# Altium schematic sheet LAB_3_page1.SchDoc
size A4; SheetNumber: 1; SheetTotal: 2
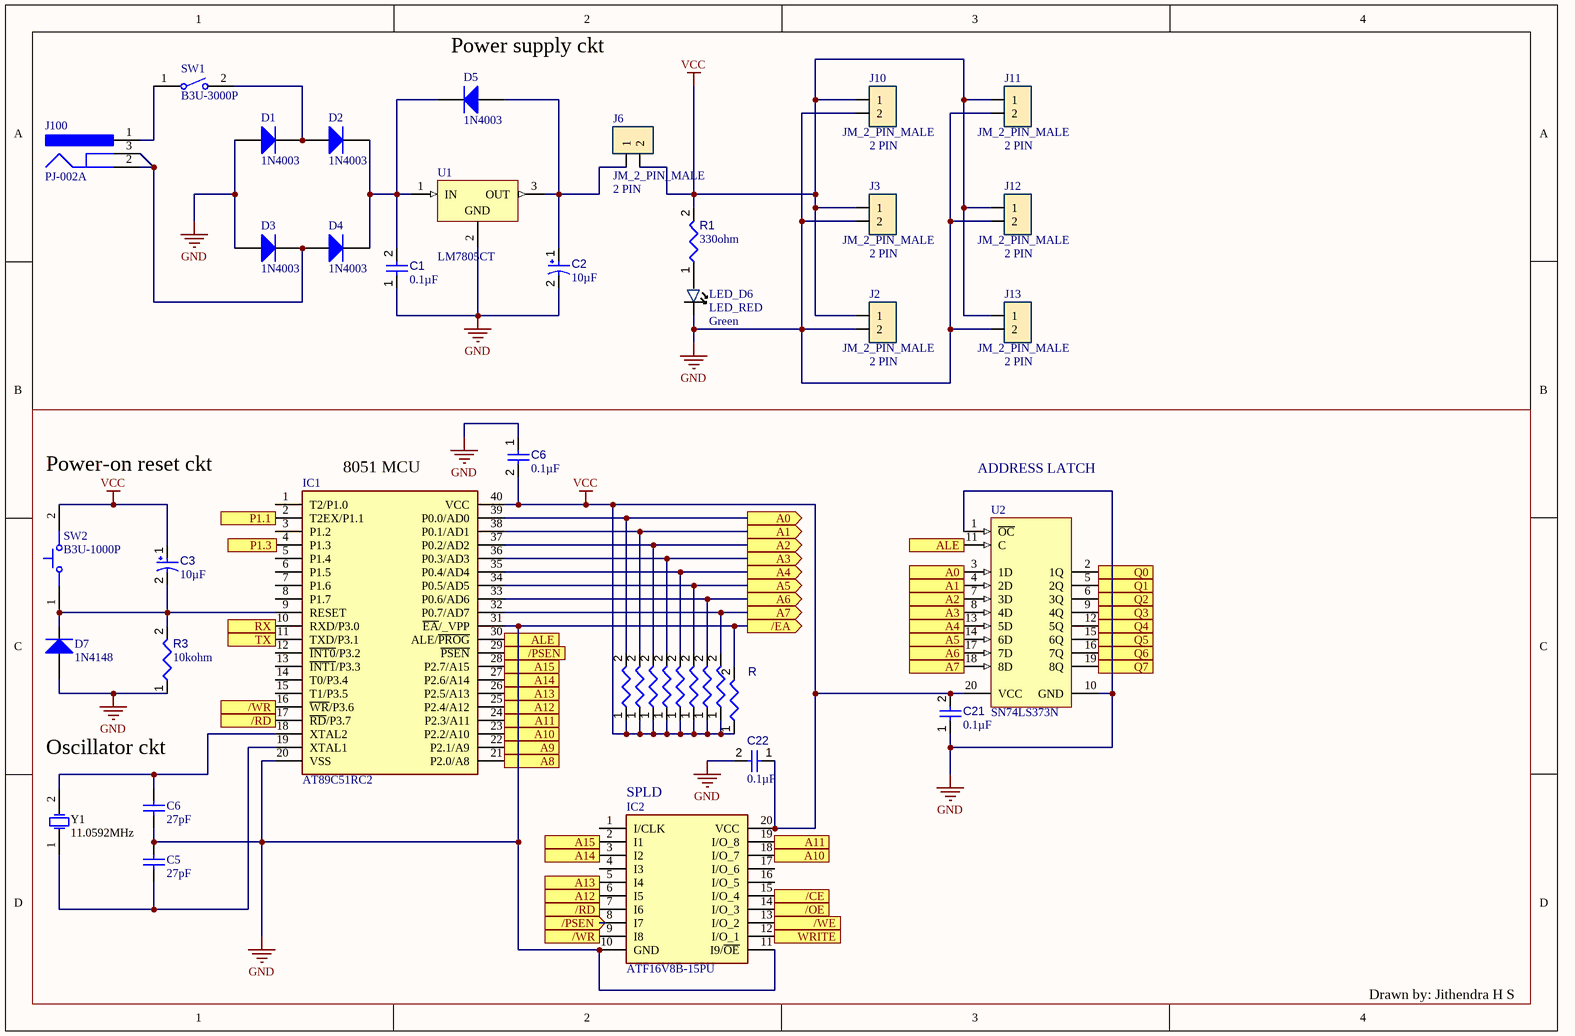
[diagram p0: LAB_3_page1.SchDoc]

## Parts
(Parts that share a designator on the sheet are numbered #1, #2 ... from top to bottom, then left to right.)
?#1  Resistor 4k7 +/-1% 1206 250 mW  [RESC3116X70X50ML13T20]  (value not drawn)
?#2  Resistor 4k7 +/-1% 1206 250 mW  [RESC3116X70X50ML13T20]  (value not drawn)
?#3  Resistor 4k7 +/-1% 1206 250 mW  [RESC3116X70X50ML13T20]  (value not drawn)
?#4  Resistor 4k7 +/-1% 1206 250 mW  [RESC3116X70X50ML13T20]  (value not drawn)
?#5  Resistor 4k7 +/-1% 1206 250 mW  [RESC3116X70X50ML13T20]  (value not drawn)
?#6  Resistor 4k7 +/-1% 1206 250 mW  [RESC3116X70X50ML13T20]  (value not drawn)
?#7  Resistor 4k7 +/-1% 1206 250 mW  [RESC3116X70X50ML13T20]  (value not drawn)
?#8  Resistor 4k7 +/-1% 1206 250 mW  [RESC3116X70X50ML13T20]  (value not drawn)
C1  value 0.1µF  [CAPC2013X145X50ML20T25]  (hidden comment: Capacitor 1 uF +/- 10% 25 V 0805)
C2  value 10µF  [CAPPR55-200-1100X500X1200]  (hidden comment: ECA1HM100)
C3  value 10µF  [CAPPR55-200-1100X500X1200]  (hidden comment: ECA1HM100)
C5  value 27pF  (hidden comment: Capacitor)
C6#1  value 0.1µF  [CAPC2013X145X50ML20T25]  (hidden comment: Capacitor 1 uF +/- 10% 25 V 0805)
C6#2  value 27pF  (hidden comment: Capacitor)
C21  value 0.1µF  [CAPC2013X145X50ML20T25]  (hidden comment: Capacitor 1 uF +/- 10% 25 V 0805)
C22  value 0.1µF  [CAPC2013X145X50ML20T25]  (hidden comment: Capacitor 1 uF +/- 10% 25 V 0805)
D1  1N4003  [FAIR-DO-41-2]
D2  1N4003  [FAIR-DO-41-2]
D3  1N4003  [FAIR-DO-41-2]
D4  1N4003  [FAIR-DO-41-2]
D5  1N4003  [FAIR-DO-41-2]
D7  1N4148  [NXP-SOD27-2_V]
IC1  AT89C51RC2  [DIP1524W56P254L5230H483Q40N]
IC2  ATF16V8B-15PU  [DIP794W59P254L2591H533Q20N]
J2  JM_2_PIN_MALE  value 2 PIN  [2_PIN_100MIL]
J3  JM_2_PIN_MALE  value 2 PIN  [2_PIN_100MIL]
J6  JM_2_PIN_MALE  value 2 PIN  [2_PIN_100MIL]
J10  JM_2_PIN_MALE  value 2 PIN  [2_PIN_100MIL]
J11  JM_2_PIN_MALE  value 2 PIN  [2_PIN_100MIL]
J12  JM_2_PIN_MALE  value 2 PIN  [2_PIN_100MIL]
J13  JM_2_PIN_MALE  value 2 PIN  [2_PIN_100MIL]
J100  PJ-002A  [CUI-PJ-002A_V]
LED_D6  LED_RED  value Green  [LED_0603]
R  Resistor 4k7 +/-1% 1206 250 mW  [RESC3116X70X50ML13T20]  (value not drawn)
R1  value 330ohm  [RESA60-630X240]  (hidden comment: MFR-25FBF52-1K)
R3  value 10kohm  [RESA60-630X240]  (hidden comment: MFR-25FBF52-100K)
SW1  B3U-3000P  [OMRON-B3U-3000P_V]
SW2  B3U-1000P  [OMRON-B3U-1000_V]
U1  LM7805CT  [FAIR-TO-220-3]
U2  SN74LS373N  [N0020A]
Y1  11.0592MHz  [FOX-FOXSLF-2_V]

## Ports
/CE (out), /EA (out), /OE (out), /PSEN (in), /PSEN (out), /RD (in), /RD (out), /WE (out), /WR, /WR (in), A0 (in), A0 (out), A1 (in), A1 (out), A2 (in), A2 (out), A3 (in), A3 (out), A4 (in), A4 (out), A5 (in), A5 (out), A6 (in), A6 (out), A7 (in), A7 (out), A8 (out), A9 (out), A10, A10 (out), A11, A11 (out), A12 (in), A12 (out), A13 (in), A13 (out), A14 (in), A14 (out), A15 (in), A15 (out), ALE (in), ALE (out), P1.1 (out), P1.3 (in), Q0, Q1, Q2, Q3, Q4, Q5, Q6, Q7, RX (in), TX (out), WRITE (out)

## Nets
GND: C1.1 C2.2 C5.2 C6#1.1 C6#2.1 C21.1 C22.2 D1.1(A) D3.1(A) D7.1(A) IC1.20(VSS) IC1.31(~{EA}/_VPP) IC2.10(GND) IC2.11(I9/~{OE}) J2.2 J3.2 J10.2 J11.2 J12.2 J13.2 LED_D6.2 R.2 R3.1 U1.2(GND) U2.1(~{OC}) U2.10(GND) ; port /EA
VCC: ?#1.1 ?#2.1 ?#3.1 ?#4.1 ?#5.1 ?#6.1 ?#7.1 ?#8.1 C3.1 C6#1.2 C21.2 C22.1 IC1.40(VCC) IC2.20(VCC) J2.1 J3.1 J6.2 J10.1 J11.1 J12.1 J13.1 R.1 R1.2 SW2.2 U2.20(VCC)
/CE: IC2.15(I/O_4) ; port /CE
/OE: IC2.14(I/O_3) ; port /OE
/PSEN: IC1.29(~{PSEN}) IC2.8(I7) ; port /PSEN
/RD: IC1.17(~{RD}/P3.7) IC2.7(I6) ; port /RD
/WE: IC2.13(I/O_2) ; port /WE
/WR: IC1.16(~{WR}/P3.6) IC2.9(I8) ; port /WR
A0: ?#1.2 IC1.39(P0.0/AD0) U2.3(1D) ; port A0
A1: ?#2.2 IC1.38(P0.1/AD1) U2.4(2D) ; port A1
A2: ?#3.2 IC1.37(P0.2/AD2) U2.7(3D) ; port A2
A3: ?#4.2 IC1.36(P0.3/AD3) U2.8(4D) ; port A3
A4: ?#5.2 IC1.35(P0.4/AD4) U2.13(5D) ; port A4
A5: ?#6.2 IC1.34(P0.5/AD5) U2.14(6D) ; port A5
A6: ?#7.2 IC1.33(P0.6/AD6) U2.17(7D) ; port A6
A7: ?#8.2 IC1.32(P0.7/AD7) U2.18(8D) ; port A7
A8: IC1.21(P2.0/A8) ; port A8
A9: IC1.22(P2.1/A9) ; port A9
A10: IC1.23(P2.2/A10) IC2.18(I/O_7) ; port A10
A11: IC1.24(P2.3/A11) IC2.19(I/O_8) ; port A11
A12: IC1.25(P2.4/A12) IC2.6(I5) ; port A12
A13: IC1.26(P2.5/A13) IC2.5(I4) ; port A13
A14: IC1.27(P2.6/A14) IC2.3(I2) ; port A14
A15: IC1.28(P2.7/A15) IC2.2(I1) ; port A15
ALE: IC1.30(ALE/~{PROG}) U2.11(C) ; port ALE
P1.1: IC1.2(T2EX/P1.1) ; port P1.1
Q0: U2.2(1Q) ; port Q0
Q1: U2.5(2Q) ; port Q1
Q2: U2.6(3Q) ; port Q2
Q3: U2.9(4Q) ; port Q3
Q4: U2.12(5Q) ; port Q4
Q5: U2.15(6Q) ; port Q5
Q6: U2.16(7Q) ; port Q6
Q7: U2.19(8Q) ; port Q7
RX: IC1.10(RXD/P3.0) ; port RX
TX: IC1.11(TXD/P3.1) ; port TX
WRITE: IC2.12(I/O_1) ; port WRITE
NetC1_2: C1.2 D2.2(K) D4.2(K) D5.2(K) U1.1(IN)
NetC2_1: C2.1 D5.1(A) J6.1 U1.3(OUT)
NetC3_2: C3.2 D7.2(K) IC1.9(RESET) R3.2 SW2.1
NetC5_1: C5.1 IC1.19(XTAL1) Y1.1
NetC6#2_2: C6#2.2 IC1.18(XTAL2) Y1.2
NetD1_2: D1.2(K) D2.1(A) SW1.2
NetD3_2: D3.2(K) D4.1(A) J100.2 J100.3
NetJ100_1: J100.1 SW1.1
NetLED_D6_1: LED_D6.1 R1.1

Not connected (* = marked no-connect by the designer): IC1 1(T2/P1.0) 3(P1.2) 4(P1.3) 5(P1.4) 6(P1.5) 7(P1.6) 8(P1.7) 12(~{INT0}/P3.2) 13(~{INT1}/P3.3) 14(T0/P3.4) 15(T1/P3.5); IC2 1(I/CLK) 4(I3) 16(I/O_5) 17(I/O_6)

## Notes on the sheet
- (near D5) Power supply ckt
- Power-on reset ckt
- (near IC1) 8051 MCU
- ADDRESS LATCH
- Oscillator ckt
- (near IC2) SPLD
- Drawn by: Jithendra H S

## Library data of the parts
?#1-?#8 R = CMP-009-00033-5: Chip Resistor, 4.7 KOhm, +/- 1%, 0.25 W, -55 to 155 degC, 1206 (3216 Metric); Power: 250mW; Voltage Rating: 200V; Pins: 2; Min Operating Temperature: -55°C; Max Operating Temperature: 155°C; Case/Package: 1206; Tolerance: 1%; RoHS Compliant: True; Mounting Technology: SM
C1 C6#1 C21 C22 = CMP-001-00010-6: Chip Capacitor, 1 uF, +/-10%, 25 V, 0805 (2012 Metric); Capacitor Type: Ceramic; Voltage Rating: 25V; RoHS Compliant: True; Pins: 2; Mounting Technology: SM; Max Operating Temperature: 125°C; Min Operating Temperature: -55°C; Tolerance: 10%; Case/Package: 0805
C2 C3 = CMP-001-00025-7: Aluminum Electrolytic Capacitor, 10 uF, +/- 20%, 50 V, -40 to 85 degC, 2-Pin THD, RoHS, Bulk; Manufacturer: Panasonic; Ripple Current (AC): 65mA; Voltage Rating: 50V; Mounting Technology: TH; RoHS Compliant: True; Capacitor Type: Electrolytic; Datasheet Version: Rev. 05, 10/2016; Min Operating Temperature: -40°C; Packaging: Bulk; Ripple Current: 65mA; Tolerance: 20%; Max Operating Temperature: 85°C; Datasheet URL: https://industrial.panasonic.com/cdbs/www-data/pdf/RDF0000/ABA0000C1218.pdf; Lead Pitch: 2mm; Pins: 2; Diameter: 5mm; Manufacturer URL: http://www.panasonic.com/; Package Reference: CAPPR55-200-1100X500X1200; Package Description: 2-Pin Radial Lead, Dia 5 mm, Height 12 mm; Case/Package: Radial; Package Quantity: 200
C5 C6#2 = Capacitor: SimulationGenericComponent: True
D1-D5 = CMP-004-00004-2: General Purpose Rectifier, 400 V, 1 A, -55 to 175 degC, 2-Pin DO-204AL (DO-41), RoHS, Tape and Reel; Manufacturer: Fairchild Semiconductor; Forward Voltage: 1.1V; Forward Current: 1A; Max Surge Current: 30A; Package Version: Rev. 2, 09/2008; Peak Reverse Current: 50A; Case/Package: DO-41-2; Pins: 2; RoHS Compliant: True; Diameter: 2.72mm; Package Reference: DO-41-2; Datasheet URL: https://www.fairchildsemi.com/datasheets/1N/1N4004.pdf; Manufacturer URL: https://www.fairchildsemi.com/; Max Operating Temperature: 175°C; Datasheet Version: Rev. 1.1.0, 11/2014; Package URL: http://www.fairchildsemi.com/dwg/DO/DO41A.pdf; Package Quantity: 5000; Min Operating Temperature: -55°C; Package Description: 2-Pin Axial Lead, Dia 2.375 mm, Body Length 4.63 mm; Mounting Technology: TH; Packaging: TapeandReel
D7 = CMP-004-00000-2: High Speed Diode, 100 V, 0.45 A, -65 to 175 degC, 2-Pin SOD27, RoHS, Bulk; Manufacturer: Fairchild; Elements: 1; Recovery Time: 4ns; Forward Current: 300mA; Power: 500mW; Forward Voltage: 1V; Max Surge Current: 4A; Peak Reverse Current: 5uA; Datasheet URL: http://www.nxp.com/documents/data_sheet/1N4148_1N4448.pdf; Min Operating Temperature: -65°C; Manufacturer URL: https://www.fairchildsemi.com/; Packaging: Bulk; Diameter: 1.91mm; Pins: 2; Package URL: http://www.nxp.com/documents/data_sheet/1N4148_1N4448.pdf; Package Reference: SOD27; Max Operating Temperature: 175°C; Package Quantity: 2000; Case/Package: DO; Datasheet Version: Aug-04; RoHS Compliant: True
IC1 = SAB-C501G-1RP: Integrated Circuit; Manufacturer_Name: SIEMENS; Datasheet Link: https://pdf1.alldatasheet.com/datasheet-pdf/view/45078/SIEMENS/SAB-C501G-1RP.html; Height: 4.83mm; Manufacturer_Part_Number: SAB-C501G-1RP
IC2 = ATF16V8B-15PU: Integrated Circuit; Manufacturer_Name: Microchip; Datasheet Link: http://ww1.microchip.com/downloads/en/devicedoc/atmel-0364-pld-atf16v8b-8bq-8bql-datasheet.pdf; Height: 5.334mm; Manufacturer_Part_Number: ATF16V8B-15PU; Mouser Part Number: 556-AF16V8B15PU; Mouser Price/Stock: https://www.mouser.co.uk/ProductDetail/Microchip-Technology-Atmel/ATF16V8B-15PU?qs=2mdvTlUeTfCsdBIzx6v3gA%3D%3D; Arrow Part Number: ATF16V8B-15PU; Arrow Price/Stock: https://www.arrow.com/en/products/atf16v8b-15pu/microchip-technology?region=nac
J2 J3 J6 J10-J13 = CMP-002-00089-1: 2.54mm Straight 2 1 Header,Breakaway Through Hole,P=2.54mm Pin Header & Female Header ROHS; MFR Part #: B-2100S02P-A110; LCSC Part#: C124375; Source: ECEN5730Lib_2023_05_DS.SchLib; Type: Extended; Pins: 2; Datasheet: https://datasheet.lcsc.com/lcsc/1811151421_Ckmtw-Shenzhen-Cankemeng-B-2100S02P-A110_C124375.pdf; Component Type: Standard; Design Item ID: JM_2_PIN_MALE
J100 = CMP-2000-06895-2: Through Hole Right Angle DC Power Jack, 2.5 A, 2 mm Center Pin, 3 Position, -25 to 85 degC, RoHS, Bulk; Manufacturer: CUIInc.; Brand: CUI; Inside Contact Diameter: 2mm; Voltage Rating: 24V; Outside Contact Diameter: 6.5mm; Current Rating: 2.5A; Insulation Resistance: 50MOhms; Contact Gender: Male; Connector Type: DCPowerJack; Datasheet Version: Rev. 1.03, 04/2016; Housing Material: PolybutyleneTerephthalate(PBT); Operating Temperature Range: -25Cto+85C; Termination Style: ThroughHole; Product Category: DCPowerConnectors; Mounting Technology: ThroughHole; Mounting Style: ThroughHole; Factory Pack Quantity: 500; Contact Plating: Nickel; Package Reference: PJ-002A; Mounting Angle: Right; Package Description: 3-Pin Through Hole Device, Body 14.4 x 9 mm, Height 11 mm; Flammability Rating: UL94V-0; Manufacturer URL: http://www.cui.com/; Product: Jacks; Contact Material: Copper; Datasheet URL: http://www.cui.com/product/resource/pj-002a.pdf; RoHS: True
LED_D6 = CMP-007-00038-1: LIGHT EMITTING DIODES (LED) GREEN 520~535NM 112~258MCD@20MA TOP VIEW 0603 ROHS; MFR Part #: 19-217/GHC-YR1S2/3T; Component Type: Standard; Type: Basic; Source: ECEN5730Lib_2023_05_DS.SchLib; Design Item ID: LED_GREEN_0603; LCSC Part#: C72043; Pins: 2
R1 = CMP-009-00048-4: Axial Resistor, 1 KOhm, +/- 1%, 250 mW, -55 to 155 degC, 2-Pin THD, RoHS, Bulk; Manufacturer: Yageo; Voltage Rating: 250V; Power: 250mW; Min Operating Temperature: -55°C; Max Operating Temperature: 155°C; Tolerance: 1%; Package Reference: MFR-25; Composition: CarbonFilm; Mounting Technology: TH; Packaging: Bulk; Case/Package: Axial; Datasheet URL: http://www.yageo.com/documents/recent/Yageo%20LR_MFR_2013.pdf; Package Quantity: 200; Manufacturer URL: http://www.yageo.com/; Package Description: 2-Pin Axial Lead, Dia 2.4 mm, Body Length 6.3 mm; Datasheet Version: Apr-13; RoHS Compliant: True
R3 = CMP-009-00045-4: Axial Resistor, 100 KOhm, +/- 1%, 0.25 W, -55 to 155 degC, 2-Pin THD, RoHS, Bulk; Manufacturer: Yageo; Power: 250mW; Voltage Rating: 250V; Case/Package: Axial; Max Operating Temperature: 155°C; Package Reference: MFR-25; Package Quantity: 200; Package Description: 2-Pin Axial Lead, Dia 2.4 mm, Body Length 6.3 mm; Tolerance: 1%; Manufacturer URL: http://www.yageo.com/; Packaging: Bulk; Mounting Technology: TH; Min Operating Temperature: -55°C; RoHS Compliant: True; Datasheet Version: Apr-13; Datasheet URL: http://www.yageo.com/documents/recent/Yageo%20LR_MFR_2013.pdf
SW1 = CMP-011-00005-2: Tactile Switch, SPST-NO, 0.05 A, 12 V, -25 to 70 degC, 2-Pin SMD, RoHS, Tape and Reel; Manufacturer: Omron Electronic Components; Operating Force: 162gf; Voltage Rating (DC): 12V; Current Rating: 50mA; IP Rating: IP40; Throw Configuration: SPST; Max Contact Resistance: 100mohm; RoHS Compliant: True; Contact Current Rating: 50mA; Manufacturer URL: http://www.omron.com/; Packaging: TapeandReel; Max Voltage Rating (DC): 12V; Contact Material: Silver; Datasheet Version: Jan-15; Package Reference: B3U-3000P; Package Description: 2-Pin Surface Mount Device, Body 4 x 3.2 mm; Min Operating Temperature: -25°C; Package Quantity: 4000; Max Operating Temperature: 70°C; Max Current Rating: 50mA; Voltage Rating: 12V; Case/Package: B3U-3000P; Mounting Technology: SM; Datasheet URL: https://www.omron.com/ecb/products/pdf/en-b3u.pdf
SW2 = CMP-011-00000-2: Tactile Switch, SPST-NO, 0.05 A, 12 V, -25 to 70 degC, 2-Pin SMD, RoHS, Tape and Reel; Manufacturer: Omron Electronic Components; IP Rating: IP40; Current Rating: 50mA; Max Contact Resistance: 100mohm; Operating Force: 153gf; Throw Configuration: SPST; Resistance: 0.1Ohm; Max Voltage Rating (DC): 12V; Contact Material: Silver; Max Current Rating: 50mA; Datasheet URL: http://www.omron.com/ecb/products/pdf/en-b3u.pdf; Mounting Technology: SM; Case/Package: B3U-1000; Packaging: TapeandReel; Package Reference: B3U-1000; Manufacturer URL: http://www.omron.com/; Datasheet Version: Jan-15; RoHS Compliant: True; Max Operating Temperature: 70°C; Contact Current Rating: 50mA; Package Quantity: 3500; Package Description: 2-Pin Surface Mount Device, Body 3 x 2.5 mm; Voltage Rating (DC): 12V; Min Operating Temperature: -25°C; Voltage Rating: 12V
U1 = CMP-2000-04938-1: Positive Voltage Regulator, 5 V, 1 A, -40 to 125 degC, 3-Pin TO-220, RoHS, Tube; Manufacturer: FairchildSemiconductor; Maximum Input Voltage: 35V; Maximum Quiescent Current: 8mA; Load Regulation: 100mV; Maximum Output Current: 2.2(Typ)A; Output Type: Fixed; Typical Dropout Voltage @ Current: 2@1AV; Rad Hard: No; Output Voltage: 5V; Accuracy: ±4%; Number of Outputs: 1; Category: LinearRegulator; Package Description: 3-Pin Through Hole Device, Body 10 x 4.5 mm, Pitch 2.54 mm; Packaging: Rail/Tube; Mounting: ThroughHole; Polarity: Positive; Manufacturer URL: https://www.fairchildsemi.com/; Line Regulation: 100mV; Datasheet Version: Aug-12; Datasheet URL: https://datasheet.ciiva.com/26904/lm7805ct-26904988.pdf; Package Reference: TO-220; Package URL: https://www.fairchildsemi.com/package-drawings/TO/TO220B03.pdf; Package: 3TO-220AB; Operating Temperature: -40to125degC; Type: Linear
U2 = CMP-1621-00373-2: Octal D-type Transparent Latches with 3-state Outputs, N0020A, TUBE; Manufacturer: Texas Instruments; VCC(Min)(V): 4.75; Logic: True; Schmitt Trigger: No; Output Type: TTL; Technology Family: LS; F @ Nom Voltage(Max)(Mhz): 35; Static Current: 40; Bits(#): 8; tpd @ Nom Voltage(Max)(ns): 18; Rating: Catalog; Voltage(Nom)(V): 5; Output Drive (IOL/IOH)(Max)(mA): 24/-2.6; VCC(Max)(V): 5.25; Output Logic: Non-inverted; 3-State Output: Yes; DatasheetVersion: SDLS165B; PackageReference: N0020A; Operating Temperature Range(C): 0 to 70; ICC @ Nom Voltage(Max)(mA): 40; Generic Part Number: SN74LS373; Code_JEDEC: MS-001; Input Type: TTL
Y1 = CMP-003-00026-2: Resistance Weld Thru-Hole Crystal, 12 MHz, +/-30 ppm, 20 pF, -20 to 70 degC, 2-Pin THD, RoHS, Bulk; Manufacturer: FOX Electronics; ESR: 60; Resistance: 60Ohm; Frequency Tolerance: 30ppm; Load Capacitance: 20pF; Tolerance: 50ppm; Max Operating Temperature: 70°C; Case/Package: FOXSLF-2; Datasheet Version: Mar-15; Mounting Technology: TH; Package Quantity: 100; Package Description: 2-Pin Through Hole Device, Body 11.35 x 4.65 mm, Pitch 4.88 mm; Packaging: Bulk; Package Reference: FOXSLF-2; RoHS Compliant: True; Pins: 2; Frequency: 11.0592MHz; Datasheet URL: http://www.foxonline.com/pdfs/hc49slf.pdf; Manufacturer URL: http://www.foxonline.com/; Min Operating Temperature: -20°C